# EasyEDA Pro project 延时继电器 - V2.eprj, board PCB
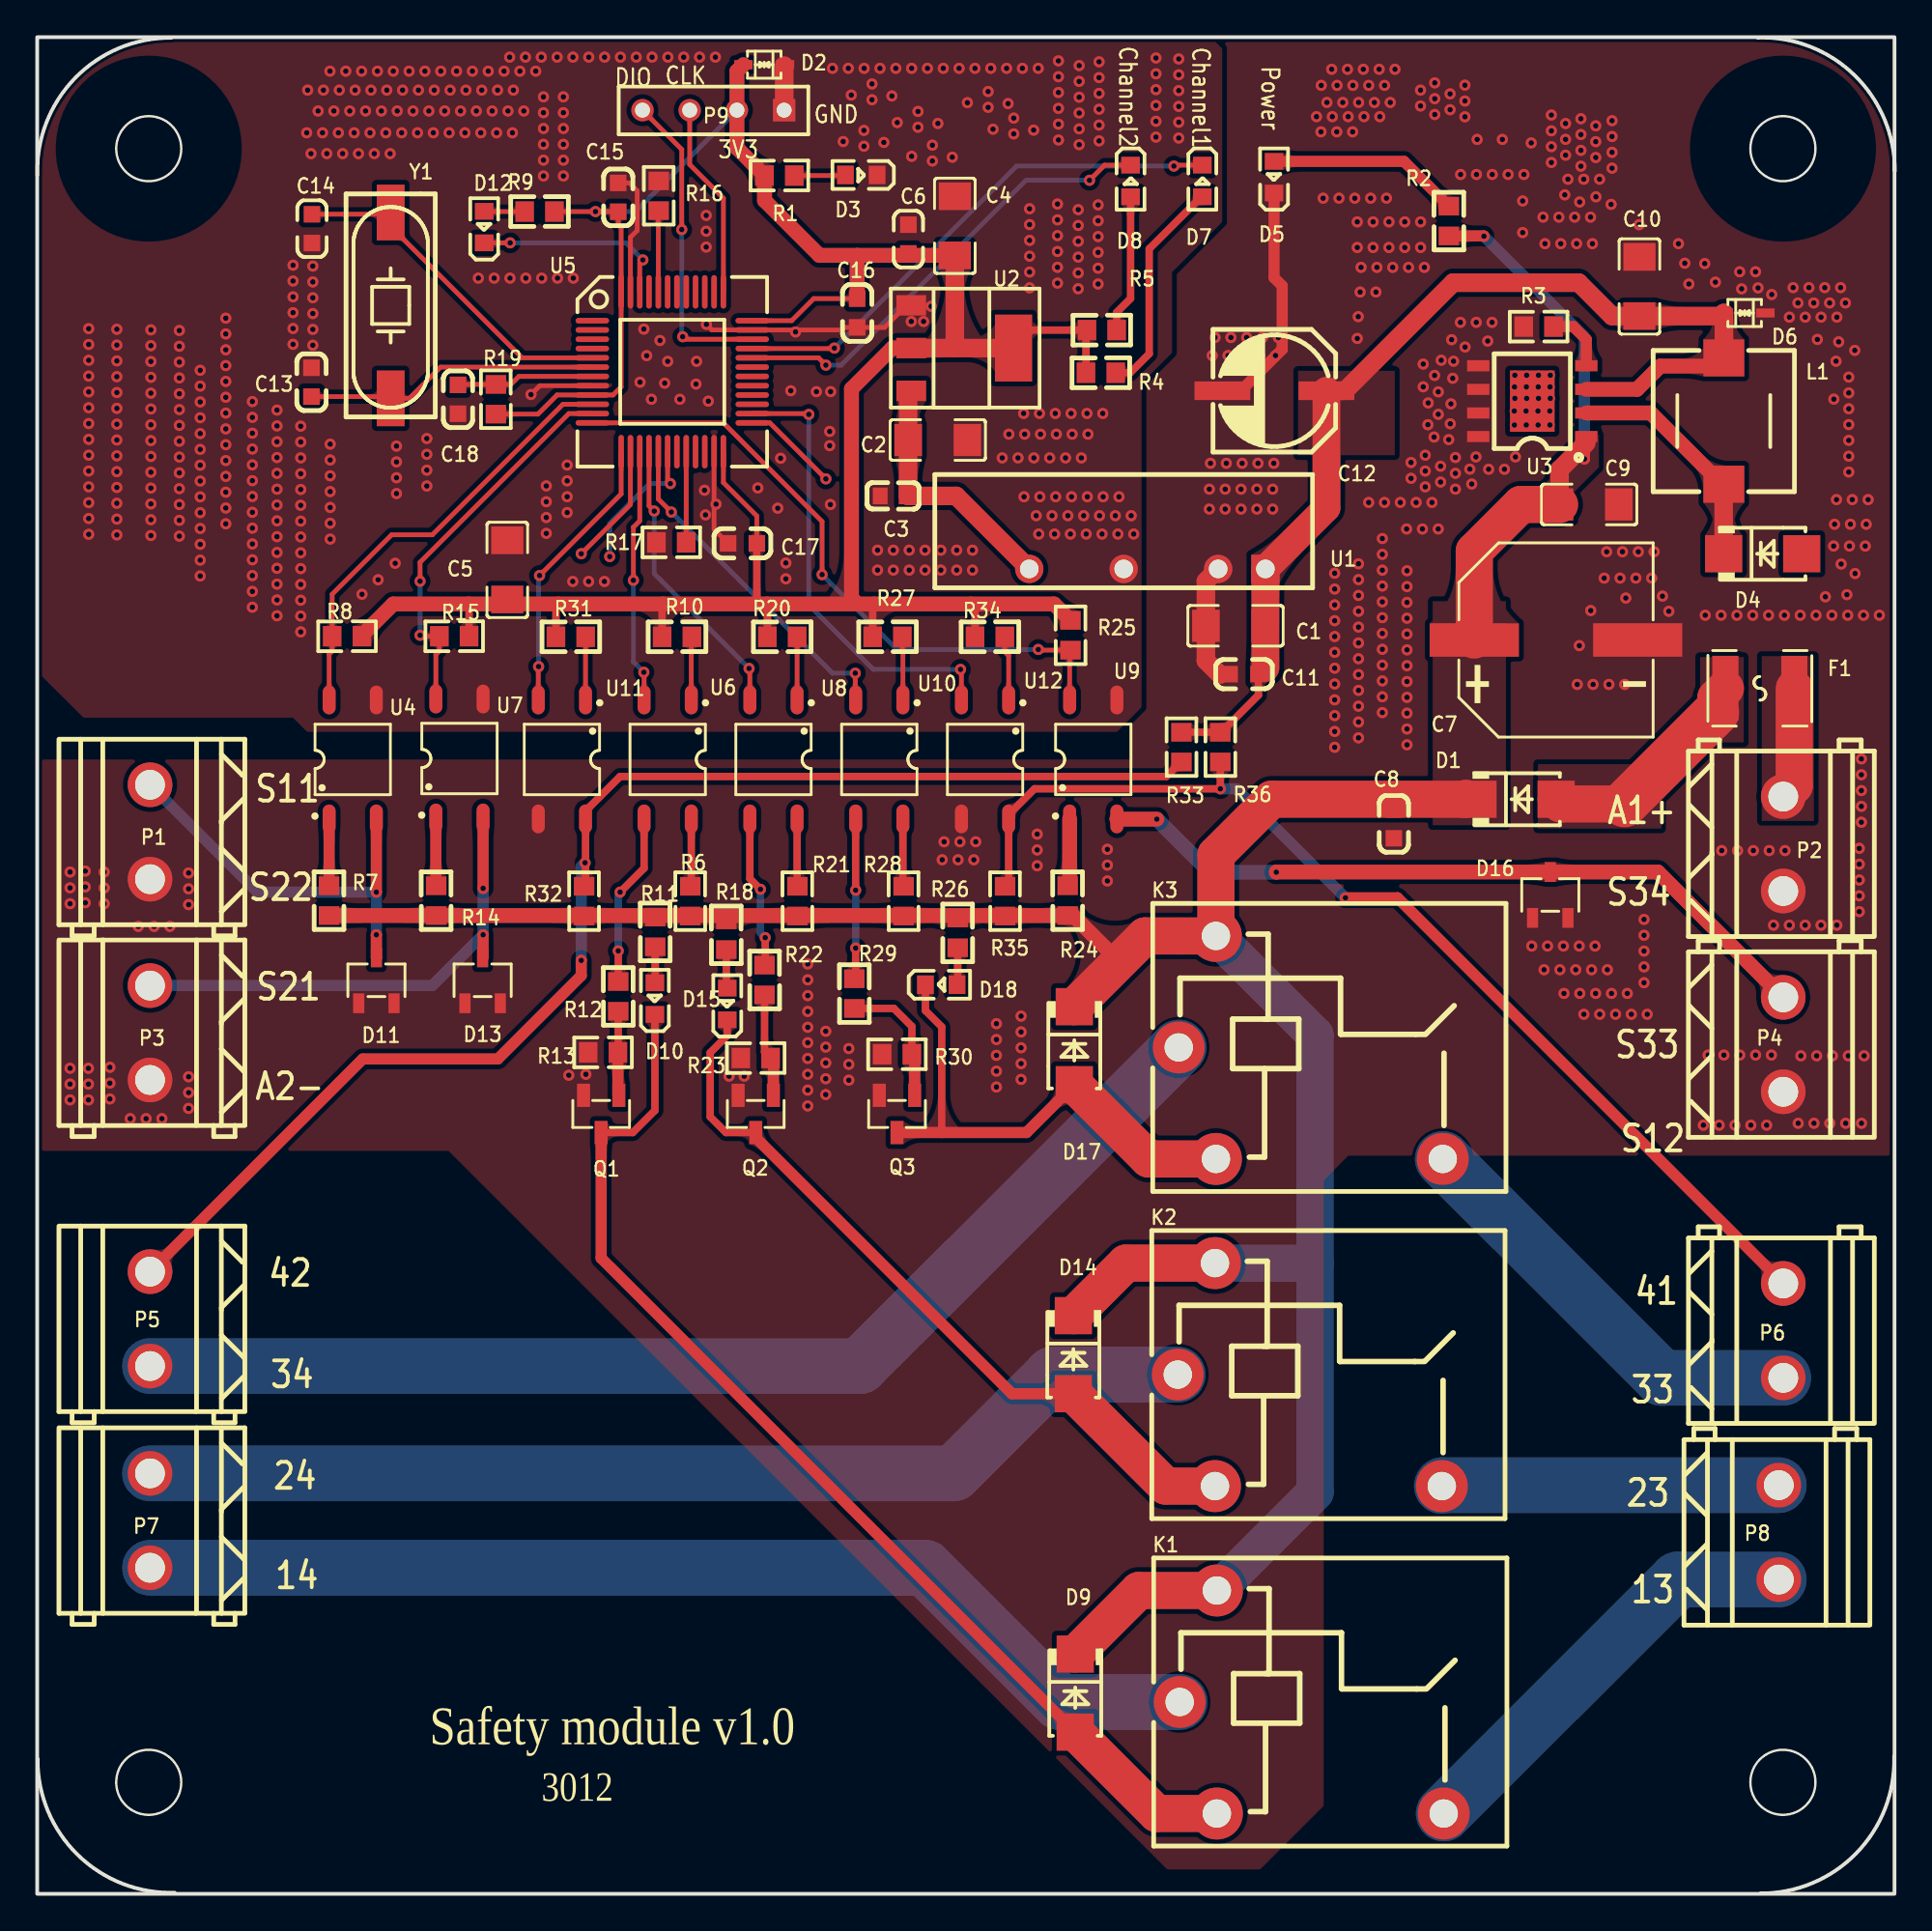
[diagram p1: board, top side]
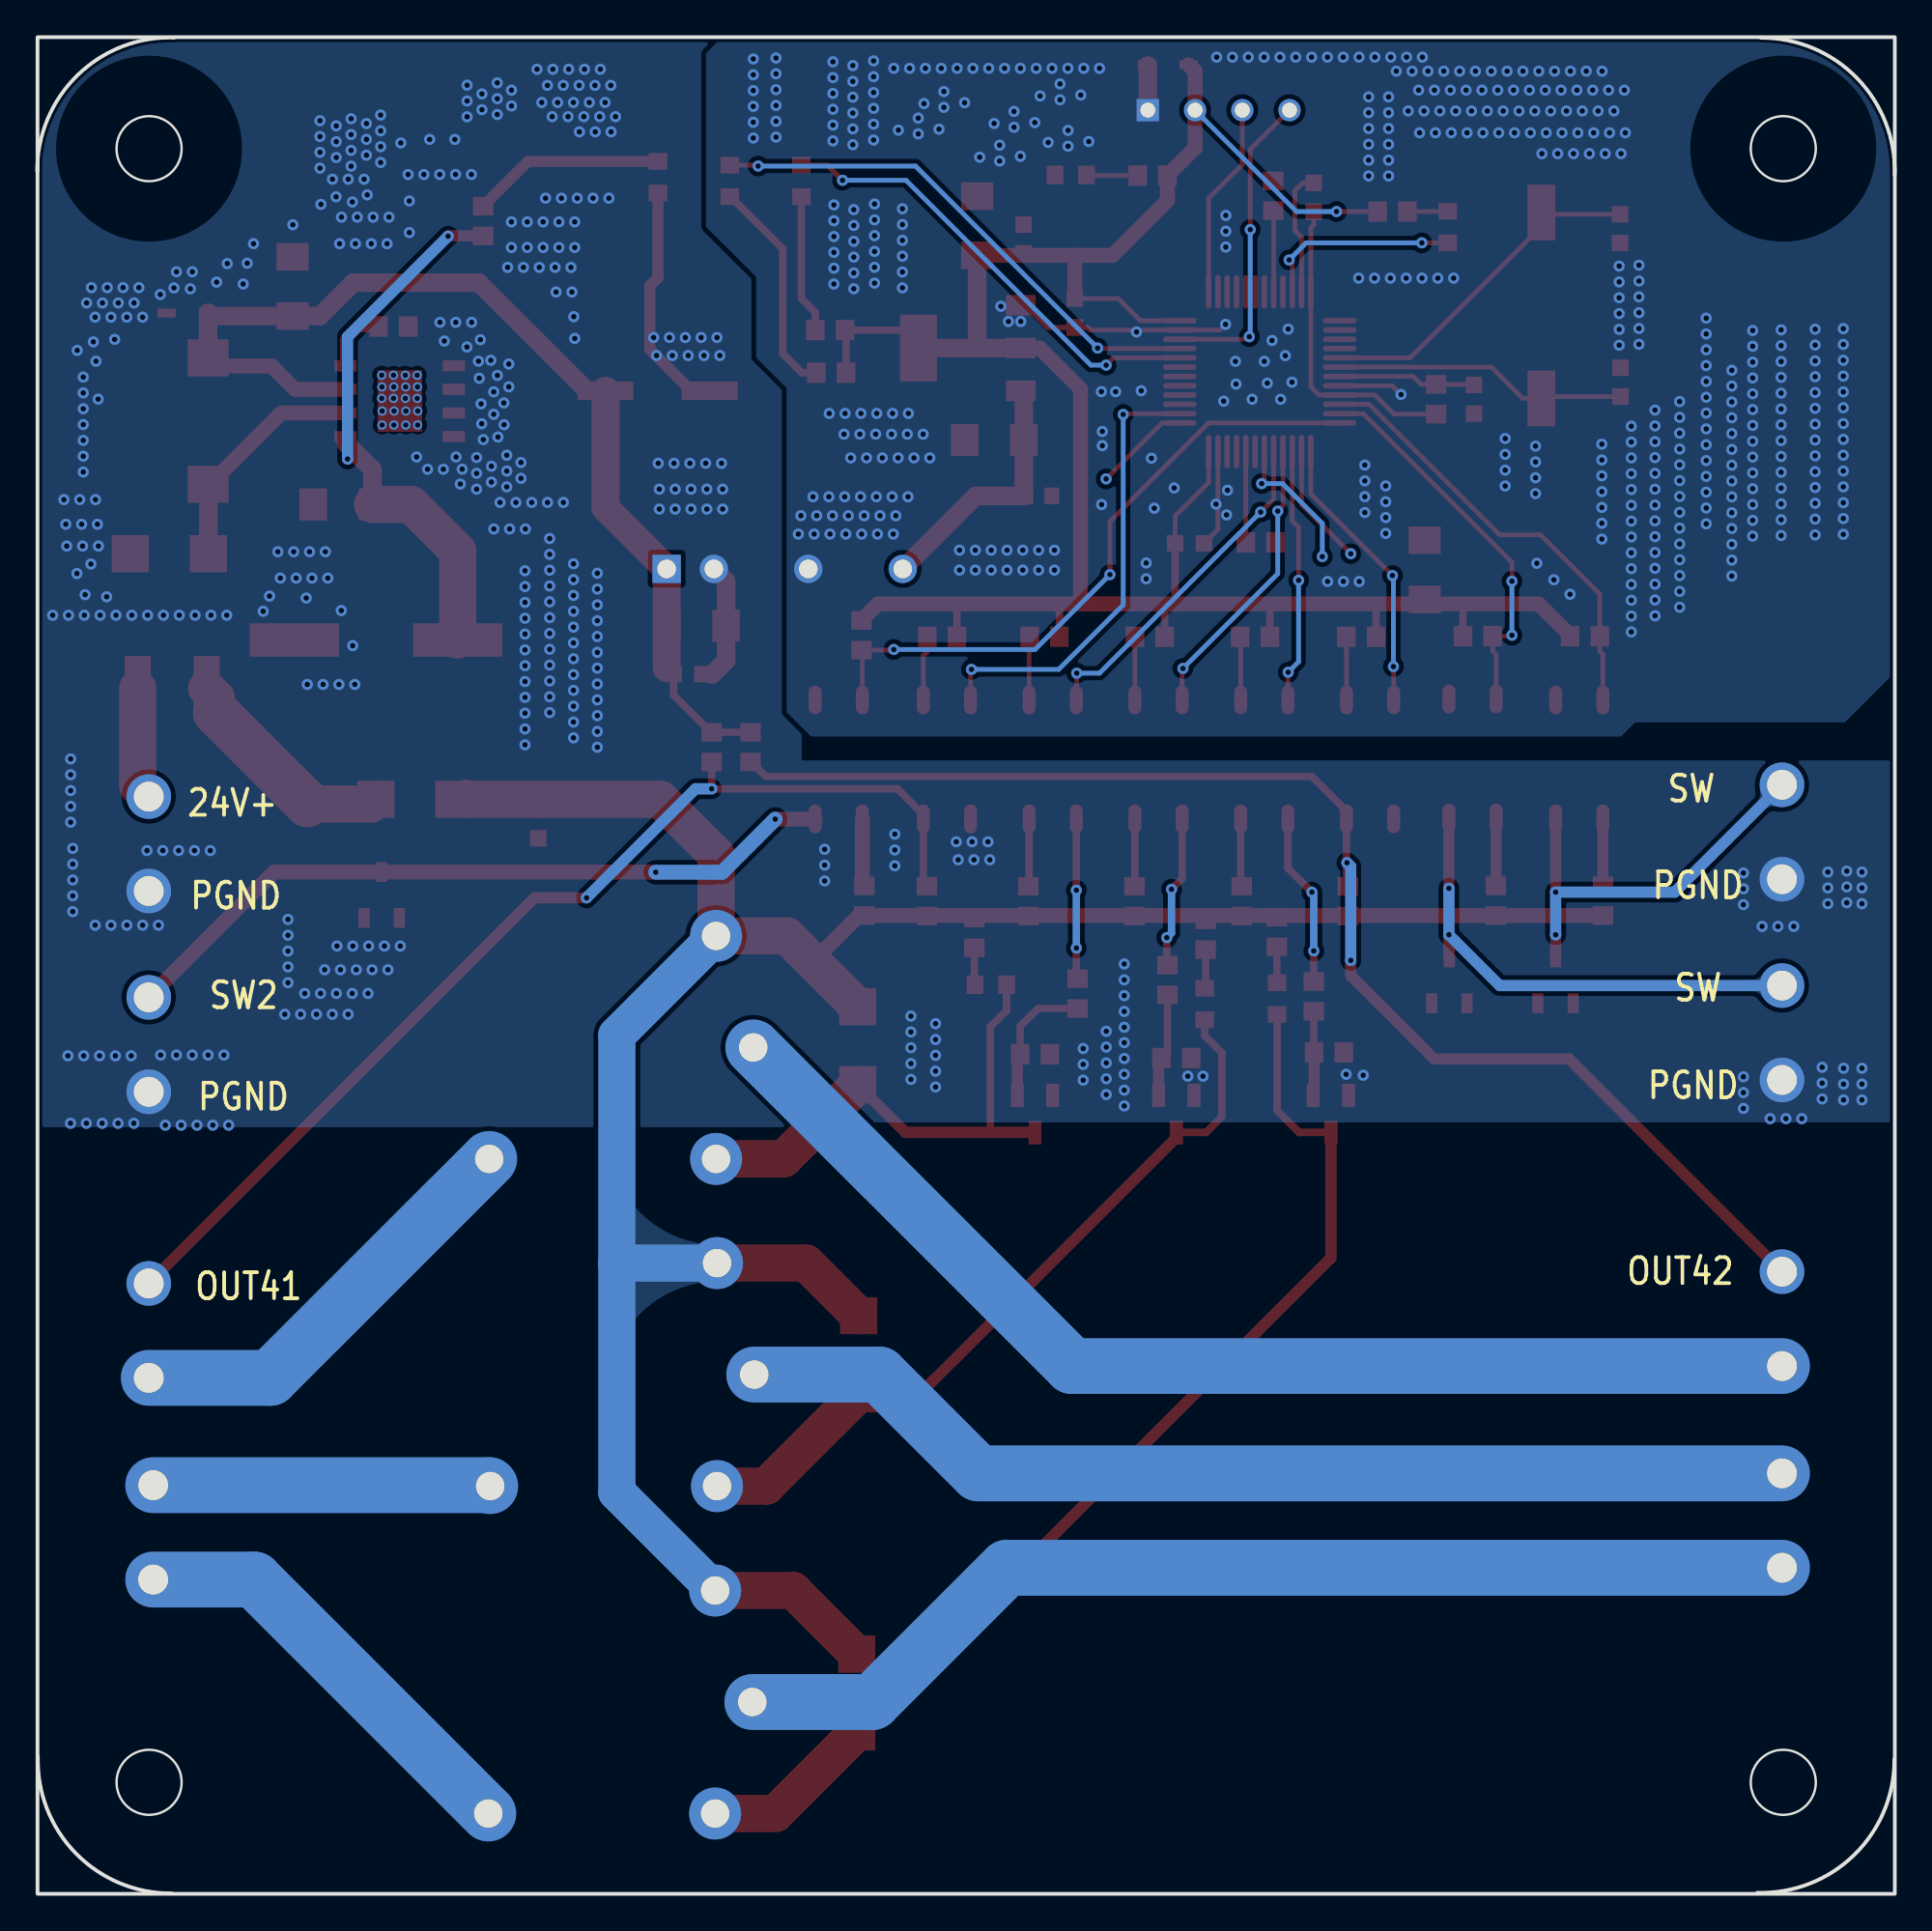
[diagram p2: board, bottom side, seen from below]

Outline 99.92 x 99.9 mm; copper layers: Top Layer, Bottom Layer. Coordinates in mm from the lower left corner of the outline.
Outline path: rectangle 0,99.9 99.9,0 ; circle c6,93.9 r1.75 ; circle c6,6 r1.75 ; circle c93.9,93.9 r1.75 ; circle c93.9,6 r1.75 ; 0.01,92.49 arc(2.04,97.7) 7.2,99.87 ; 7.4,0.06 arc(2.19,2.09) 0.02,7.25 ; 92.54,99.88 arc(97.75,97.85) 99.92,92.69 ; 99.88,7.4 arc(97.85,2.19) 92.69,0.02
Stack: Top Layer 0.035mm / Dielectric1 1.51mm FR4 er 4.5 / Bottom Layer 0.035mm

## Design rules (mm)
template: 用户自定义配置
spacing Default (default): track to track 0.152, other pairs 0 to 0.152
track width Default (default): min 0.254, default 0.254, max 25.4
differential pair differentialPair (default): width min 0.127, default 0.254, max 2.54; gap min 0.152, default 0.152
via Default (default): diameter min 0.25, default 0.61, max 100.025; hole min 0.2, default 0.305, max 59.995

## Placement (name value [footprint] x y rotation side)
C1  4.7uF  [C1206]  64.45 68.23 0 top
C2  4.7uF  [C1206]  48.44 78.22 180 top
C3  104  [C0603]  46.04 75.22 0 top
C4  4.7uF  [C1206]  49.36 89.75 270 top
C5  4.7uF  [C1206]  25.29 71.24 270 top
C6  104  [0603C]  46.86 89.04 270 top
C7  100uF/50V  [CAP-SMD_BD10.0-L10.3-W10.3-LS11.0-R-RD]  81.69 67.46 180 top
C8  104  [0603C]  72.97 57.57 90 top
C9  10uF  [C1206]  83.48 74.76 180 top
C10  10uF  [C1206]  86.18 86.49 90 top
C11  104  [0603C]  64.91 65.63 0 top
C12  100uF/35V  [电解电容贴片6X6]  66.55 80.88 180 top
C13  100pF  [0603C]  14.75 81.34 90 top
C14  100pF  [0603C]  14.78 89.6 270 top
C15  104  [0603C]  31.25 91.28 270 top
C16  104  [0603C]  44.11 85.06 90 top
C17  104  [0603C]  37.93 72.67 0 top
C18  104  [0603C]  22.63 80.42 90 top
D1  SS56  [SMA]  79.6 58.9 0 top
D2  PESD3V3L1BA-N  [SOD-323_L1.8-W1.3-LS2.5-BI]  39.11 98.42 180 top
D3  红光  [0603LED]  44.36 92.5 0 top
D4  SS34  [SMA]  92.81 72.1 0 top
D5  绿光  [0603LED]  66.55 92.33 270 top
D6  PESD5V0L1BA-N  [SOD-323_L1.8-W1.3-LS2.5-BI]  91.84 85.06 180 top
D7  绿光  [0603LED]  62.65 92.2 90 top
D8  绿光  [0603LED]  58.79 92.2 90 top
D9  SS56  [SMA]  55.84 10.8 270 top
D10  绿光  [0603LED]  33.24 48.13 270 top
D11  PESD24VL2BTN  [SOT-23-3_L2.9-W1.6-P1.90-LS2.8-BR]  18.25 49.15 270 top
D12  绿光  [0603LED]  24.06 89.65 270 top
D13  PESD24VL2BTN  [SOT-23-3_L2.9-W1.6-P1.90-LS2.8-BR]  23.96 49.15 270 top
D14  SS56  [SMA]  55.73 29.01 270 top
D15  绿光  [0603LED]  37.13 47.85 270 top
D16  PESD24VL2BTN  [SOT-23-3_L2.9-W1.6-P1.90-LS2.8-BR]  81.39 53.74 270 top
D17  SS56  [SMA]  55.78 45.63 270 top
D18  绿光  [0603LED]  48.59 48.9 180 top
F1  mSMD030  [F1812]  92.66 64.86 180 top
K1  JQC-3FF/24VDC-1HS(551)  [RELAY-TH_JQC-3FF-1HXX]  68.55 10.32 0 top
K2  JQC-3FF/24VDC-1HS(551)  [RELAY-TH_JQC-3FF-1HXX]  68.45 27.94 0 top
K3  JQC-3FF/24VDC-1HS(551)  [RELAY-TH_JQC-3FF-1HXX]  68.5 45.54 0 top
L1  68uH  [IND-SMD_L7.0-W7.0_SMDRI74-330MT]  90.72 79.24 270 top
P1  5.08-2P  [CONN-TH_2P-P5.08_DB128L-5.08-2P]  6.07 57.13 90 top
P2  5.08-2P  [CONN-TH_2P-P5.08_DB128L-5.08-2P]  93.92 56.5 270 top
P3  5.08-2P  [CONN-TH_2P-P5.08_DB128L-5.08-2P]  6.07 46.33 90 top
P4  5.08-2P  [CONN-TH_2P-P5.08_DB128L-5.08-2P]  93.92 45.7 270 top
P5  5.08-2P  [CONN-TH_2P-P5.08_DB128L-5.08-2P]  6.07 30.94 90 top
P6  5.08-2P  [CONN-TH_2P-P5.08_DB128L-5.08-2P]  93.92 30.3 270 top
P7  5.08-2P  [CONN-TH_2P-P5.08_DB128L-5.08-2P]  6.07 20.08 90 top
P8  5.08-2P  [CONN-TH_2P-P5.08_DB128L-5.08-2P]  93.68 19.45 270 top
P9  4P  [SIP4]  40.18 95.97 180 top
Q1  SS8050  [SOT-23-3_L2.9-W1.3-P1.90-LS2.4-BR]  30.34 41.96 90 top
Q2  SS8050  [SOT-23-3_L2.9-W1.3-P1.90-LS2.4-BR]  38.65 41.96 90 top
Q3  SS8050  [SOT-23-3_L2.9-W1.3-P1.90-LS2.4-BR]  46.25 41.96 90 top
R1  50K  [0603R]  39.92 92.45 0 top
R2  47K  [0603R]  75.93 90.01 270 top
R3  10K  [0603R]  80.76 84.33 180 top
R4  10K  [0603R]  57.21 81.85 180 top
R5  10K  [0603R]  57.26 84.14 180 top
R6  10K  [0603R]  33.24 51.76 90 top
R7  10K  [0603R]  15.7 53.44 90 top
R8  10K  [0603R]  16.67 67.67 180 top
R9  10K  [0603R]  27.02 90.52 0 top
R10  1K  [0603R]  34.41 67.64 0 top
R11  10K  [0603R]  35.13 53.41 90 top
R12  1K  [0603R]  31.25 48.29 270 top
R13  10K  [0603R]  30.44 45.28 180 top
R14  10K  [0603R]  21.46 53.44 90 top
R15  10K  [0603R]  22.43 67.67 180 top
R16  10K  [0603R]  33.43 91.37 270 top
R17  10K  [0603R]  34.11 72.72 0 top
R18  10K  [0603R]  37.07 51.6 90 top
R19  10K  [0603R]  24.67 80.42 90 top
R20  1K  [0603R]  40.08 67.64 0 top
R21  10K  [0603R]  40.89 53.41 90 top
R22  1K  [0603R]  39.12 49.17 270 top
R23  10K  [0603R]  38.65 44.97 180 top
R24  10K  [0603R]  55.43 53.44 90 top
R25  10K  [0603R]  55.58 67.72 270 top
R26  10K  [0603R]  49.51 51.7 90 top
R27  1K  [0603R]  45.74 67.64 0 top
R28  10K  [0603R]  46.6 53.41 90 top
R29  1K  [0603R]  43.95 48.44 270 top
R30  10K  [0603R]  46.25 45.18 180 top
R31  1K  [0603R]  28.7 67.64 0 top
R32  10K  [0603R]  29.42 53.41 90 top
R33  10K  [0603R]  61.55 61.7 270 top
R34  1K  [0603R]  51.25 67.64 0 top
R35  10K  [0603R]  52.06 53.41 90 top
R36  10K  [0603R]  63.64 61.7 270 top
U1  B0505LS-1WR3  [PWRM-TH_BXXXXLS-1WR3]  59.71 71.29 180 top
U2  1117-3.3  [SOT-223]  49.72 83.17 270 top
U3  XL1509-5.0E1  [ESOP-8_L4.9-W3.9-P1.27-LS6.0-BL-EP]  80.42 80.32 90 top
U4  LTV-357T-C  [SOP-4_L4.4-W3.9-P2.54-LS7.0-TL]  16.97 61.04 90 top
U5  STM32F103C8T6/CBT6  [LQFP48]  34.16 81.9 0 top
U6  LTV-357T-C  [SOP-4_L4.4-W3.9-P2.54-LS7.0-TL]  33.91 61.04 270 top
U7  LTV-357T-C  [SOP-4_L4.4-W3.9-P2.54-LS7.0-TL]  22.71 61.09 90 top
U8  LTV-357T-C  [SOP-4_L4.4-W3.9-P2.54-LS7.0-TL]  39.6 61.04 270 top
U9  LTV-357T-C  [SOP-4_L4.4-W3.9-P2.54-LS7.0-TL]  56.8 61.04 90 top
U10  LTV-357T-C  [SOP-4_L4.4-W3.9-P2.54-LS7.0-TL]  45.29 61.04 270 top
U11  LTV-357T-C  [SOP-4_L4.4-W3.9-P2.54-LS7.0-TL]  28.22 61.04 270 top
U12  LTV-357T-C  [SOP-4_L4.4-W3.9-P2.54-LS7.0-TL]  50.98 61.04 270 top
Y1  8M  [晶振贴片]  19.01 85.47 270 top

## Footprints (pads in the part's own frame, mm; a bottom-side part is the same pattern mirrored in y, then rotated)
0603C
  rect 0.889x0.889 smd: 1(-0.774,0) 2(0.774,0)
0603LED
  rect 0.9x1 smd: 1(-0.884,-0.017) 2(0.816,-0.017)
0603R
  rect 1x1.1 smd: 1(-0.8,0) 2(0.8,0)
C0603
  rect 0.8x0.9 smd: 1(-0.7,0) 2(0.7,0)
C1206
  rect 1.485x1.728 smd: 1(-1.593,0) 2(1.593,0)
CAP-SMD_BD10.0-L10.3-W10.3-LS11.0-R-RD
  rect 4.8x1.8 smd: 1(4.395,0) 2(-4.395,0)
CONN-TH_2P-P5.08_DB128L-5.08-2P
  round 2.401 hole 1.6: 1(-2.54,0) 2(2.54,0)
ESOP-8_L4.9-W3.9-P1.27-LS6.0-BL-EP
  rect 0.6x1.2 smd: 1(-1.905,-2.909) 2(-0.635,-2.909) 3(0.635,-2.909) 4(1.905,-2.909) 5(1.905,2.909) 6(0.635,2.909) 7(-0.635,2.909) 8(-1.905,2.909)
  rect 3.3x2.4 smd: 9(0,0)
F1812
  rect 1.407x3.499 smd: 1(-1.853,0) 2(1.853,0)
IND-SMD_L7.0-W7.0_SMDRI74-330MT
  rect 2x2.2 smd: 1(-3.4,0) 2(3.4,0)
LQFP48
  oval 1.8x0.3 smd: 1(-4.3,2.75) 2(-4.3,2.25) 3(-4.3,1.75) 4(-4.3,1.25) 5(-4.3,0.75) 6(-4.3,0.25) 7(-4.3,-0.25) 8(-4.3,-0.75) 9(-4.3,-1.25) 10(-4.3,-1.75) 11(-4.3,-2.25) 12(-4.3,-2.75) 25(4.3,-2.75) 26(4.3,-2.25) 27(4.3,-1.75) 28(4.3,-1.25) 29(4.3,-0.75) 30(4.3,-0.25) 31(4.3,0.25) 32(4.3,0.75) 33(4.3,1.25) 34(4.3,1.75) 35(4.3,2.25) 36(4.3,2.75)
  oval 0.3x1.8 smd: 13(-2.75,-4.3) 14(-2.25,-4.3) 15(-1.75,-4.3) 16(-1.25,-4.3) 17(-0.75,-4.3) 18(-0.25,-4.3) 19(0.25,-4.3) 20(0.75,-4.3) 21(1.25,-4.3) 22(1.75,-4.3) 23(2.25,-4.3) 24(2.75,-4.3) 37(2.75,4.3) 38(2.25,4.3) 39(1.75,4.3) 40(1.25,4.3) 41(0.75,4.3) 42(0.25,4.3) 43(-0.25,4.3) 44(-0.75,4.3) 45(-1.25,4.3) 46(-1.75,4.3) 47(-2.25,4.3) 48(-2.75,4.3)
PWRM-TH_BXXXXLS-1WR3
  rect 1.524x1.524 hole 1: 1(-6.35,0)
  round 1.524 hole 1: 2(-3.81,0) 4(1.27,0) 6(6.35,0)
RELAY-TH_JQC-3FF-1HXX
  round 2.794 hole 1.524: 1(-5.1,6) 2(-5.1,-6) 3(7.1,-6) 4(-7.1,0)
SIP4
  rect 1.2x1.2 hole 0.8: 1(0,0)
  round 1.2 hole 0.8: 2(2.54,0) 3(5.08,0) 4(7.62,0)
SMA
  rect 2x2 smd: 1(2.1,0) 2(-2.1,0)
SOD-323_L1.8-W1.3-LS2.5-BI
  rect 0.986x0.49 smd: 1(-1.117,0) 2(1.117,0)
SOP-4_L4.4-W3.9-P2.54-LS7.0-TL
  oval 1.55x0.7 smd: 1(-3.2,1.27) 2(-3.2,-1.27) 3(3.2,-1.27) 4(3.2,1.27)
SOT-23-3_L2.9-W1.3-P1.90-LS2.4-BR
  rect 1.25x0.7 smd: 1(1,-0.95) 2(1,0.95) 3(-1,0)
SOT-23-3_L2.9-W1.6-P1.90-LS2.8-BR
  rect 1.07x0.6 smd: 1(1.235,-0.95) 2(1.235,0.95) 3(-1.235,0)
SOT-223
  rect 1.1x1.6 smd: 1(-2.3,-2.7) 2(0,-2.7) 3(2.3,-2.7)
  rect 3.6x2 smd: 4(0,2.8)
晶振贴片
  rect 3x1.5 smd: 1(-5,0) 2(5,0)
电解电容贴片6X6
  rect 3x1 smd: 1(-2.8,0) 2(2.8,0)

## Nets
As in the schematic.

Pads without a net: U3 9; U5 1 2 3 4 18 21 22 45

## Via types
v1: diameter 0.5, hole 0.3, Top Layer to Bottom Layer, 20 vias
v2: diameter 0.6, hole 0.3, Top Layer to Bottom Layer, 919 vias

## Routing (per net, layer and track width the routed paths; a pad name or vN(x,y) marks a point on that pad's centre or on a via; arc(x,y) is an arc through that point)
3V3: length 150.1
  Top Layer w0.254: C17.2 38.71,74.13 36.91,75.93 36.91,77.6 ; U5.36 40.58,84.65 41.77,85.83 C16.2 ; R19.1 26.93,79.62 27.96,80.65 U5.9 30.97,80.65 31.41,81.08 U5.48 31.41,89.65 31.25,89.81 C15.2 31.24,90.52 v2(30.03,90.52) R9.2
  Top Layer w0.4: R34.1 50.45,69.17 50.22,69.4 ; U2.4 53.48,84.14 R5.2 56.41,84.09 R4.2 ; 39.28,67.64 39.28,69.38 39.25,69.4 ; 28.02,69.4 27.9,69.28 R31.1 ; 33.66,69.4 33.61,69.36 R10.1 ; 38.71,69.4 38.71,69.41 C17.2 ; R15.1 23.23,69.38 23.21,69.4 ; 45.02,69.4 44.94,69.32 R27.1
  Top Layer w0.8: D2.2 37.64,98.07 P9.2 37.64,93.94 R1.1 39.12,91.11 42.08,88.16 44.11,88.16 ; 44.11,88.16 C16.2 ; 44.11,88.16 C4.2 ; 44.11,69.4 19.15,69.4 17.47,67.72 R8.1 ; 44.11,69.4 43.8,69.72 43.8,80.98 45.99,83.17 U2.2 ; 44.11,69.4 54.7,69.4 55.58,68.52
  Top Layer w1: 49.32,83.17 49.36,83.21 C4.2 ; 49.32,83.17 U2.4 ; 49.32,83.17 U2.2
  Bottom Layer w0.254: v2(30.03,90.52) 32.18,90.52 P9.2
5V_MCU: length 13.9
  Top Layer w1: U1.6 49.43,75.22 46.85,75.22 46.85,80.7 U2.3
5V_VCC: length 57.5
  Top Layer w0.4: C11.2 65.69,64.5 63.69,62.5 R36.1 R33.1
  Top Layer w0.8: U3.3 86.05,80.95 87.3,82.2 90.28,82.2 90.72,82.64
  Top Layer w1: 90.72,82.64 90.72,82.65 D6.2 90.56,84.89 C10.1 84.71,84.89 82.92,86.69 76.16,86.69 70.35,80.88 C12.1
  Top Layer w1.5: 66.06,65.96 U1.1 69.35,74.57 C12.1
24V: length 6.1
  Top Layer w2: F1.1 94.51,59.63 P2.1
PGND: length 19
  Top Layer w0.6: C12.2 64.75,80.88 66.97,83.1 66.97,86.52 66.53,86.96 D5.2
  Top Layer w1: U1.2 62.86,70.63 C1.1 62.86,66.35 63.61,65.6
  vias: v2(1.77,54.98) v2(1.77,54.13) v2(1.77,53.28) v2(1.77,44.42) v2(1.77,43.57) v2(1.77,42.72) v2(2.58,55.03) v2(2.58,54.18) v2(2.58,53.33) v2(2.76,44.42) v2(2.76,43.57) v2(2.76,42.72) v2(3.6,54.98) v2(3.6,54.13) v2(3.6,53.28) v2(3.91,44.47) v2(3.91,43.62) v2(3.91,42.77) v2(5,41.71) v2(5.44,52.05) v2(5.86,41.71) v2(6.29,52.05) v2(6.71,41.71) v2(7.14,52.05) v2(8.14,54.93) v2(8.14,54.08) v2(8.14,53.22) v2(8.14,43.96) v2(8.14,43.11) v2(8.14,42.26) v2(28.59,44.05) v2(29.51,44.1) v2(37.21,43.99) v2(38.03,43.99) v2(41.45,50.03) v2(41.45,49.18) v2(41.45,48.33) v2(41.45,47.48) v2(41.45,46.63) v2(41.45,45.8) v2(41.45,44.95) v2(41.45,44.1) v2(41.45,43.24) v2(41.45,42.39) v2(42.42,46.41) v2(42.42,45.56) v2(42.42,44.71) v2(42.42,43.86) v2(42.42,43) v2(43.66,45.48) v2(43.66,44.63) v2(43.66,43.78) v2(48.68,55.64) v2(48.78,56.61) v2(49.53,55.64) v2(49.63,56.61) v2(50.38,55.64) v2(50.48,56.61) v2(51.6,46.82) v2(51.6,45.97) v2(51.6,45.12) v2(51.6,44.26) v2(51.6,43.41) v2(52.92,47.23) v2(52.92,46.38) v2(52.92,45.52) v2(52.92,44.67) v2(52.92,43.82) v2(53.79,57.02) v2(53.79,56.17) v2(53.79,55.32) v2(57.56,56.2) v2(57.56,55.35) v2(57.56,54.5) v2(63.11,76.97) v2(63.05,75.58) v2(63.05,74.51) v2(63.2,82.77) v2(63.35,83.74) v2(63.9,75.58) v2(63.9,74.51) v2(63.96,76.97) v2(64.05,82.77) v2(64.21,83.74) v2(64.81,76.97) v2(64.75,75.58) v2(64.75,74.51) v2(64.9,82.77) v2(65.06,83.74) v2(65.6,75.58) v2(65.6,74.51) v2(65.66,76.97) v2(65.76,82.77) v2(65.91,83.74) v2(66.45,75.58) v2(66.45,74.51) v2(66.61,82.77) v2(66.51,76.97) v2(66.76,83.74) v2(68.81,95.62) v2(69.07,97.31) v2(69.05,94.81) v2(69.17,91.24) v2(69.37,96.39) v2(69.63,98.17) v2(69.66,95.62) v2(69.79,71.06) v2(69.79,70.2) v2(69.79,69.35) v2(69.79,68.5) v2(69.79,67.65) v2(69.79,66.8) v2(69.79,65.95) v2(69.79,65.1) v2(69.79,64.25) v2(69.79,63.39) v2(69.79,62.54) v2(69.79,61.69) v2(69.9,94.81) v2(69.92,97.31) v2(70.02,91.24) v2(70.22,96.39) v2(70.48,98.17) v2(70.51,95.62) v2(70.77,97.31) v2(70.75,94.81) v2(70.87,91.24) v2(71,89.96) v2(71,88.58) v2(71,83.69) v2(71.07,96.39) v2(71.06,84.86) v2(71.07,71.56) v2(71.07,70.71) v2(71.07,69.86) v2(71.07,69.01) v2(71.07,68.16) v2(71.07,67.31) v2(71.07,66.46) v2(71.07,65.6) v2(71.07,64.75) v2(71.07,63.9) v2(71.07,63.05) v2(71.07,62.2) v2(71.21,87.51) v2(71.16,86.19) v2(71.33,98.17) v2(71.37,95.62) v2(71.62,97.31) v2(71.62,74.87) v2(71.72,91.24) v2(71.86,89.96) v2(71.86,88.58) v2(71.93,96.39) v2(72.01,86.19) v2(72.06,87.51) v2(72.18,98.17) v2(72.22,95.62) v2(72.35,72.92) v2(72.35,72.07) v2(72.35,71.22) v2(72.35,70.37) v2(72.35,69.52) v2(72.35,68.67) v2(72.35,67.81) v2(72.35,66.96) v2(72.35,66.11) v2(72.35,65.26) v2(72.35,64.41) v2(72.35,63.56) v2(72.47,97.31) v2(72.47,74.87) v2(72.57,91.24) v2(72.71,89.96) v2(72.71,88.58) v2(72.78,96.39) v2(72.91,87.51) v2(73.03,98.17) v2(73.32,74.87) v2(73.56,89.96) v2(73.56,88.58) v2(73.66,73.44) v2(73.68,71.19) v2(73.68,70.34) v2(73.68,69.49) v2(73.68,68.63) v2(73.68,67.78) v2(73.68,66.93) v2(73.68,66.08) v2(73.68,65.23) v2(73.68,64.38) v2(73.68,63.53) v2(73.68,62.68) v2(73.68,61.82) v2(73.76,87.51) v2(73.9,77.01) v2(73.9,76.16) v2(74.17,74.87) v2(74.41,97.05) v2(74.41,96.2) v2(74.41,89.96) v2(74.41,88.58) v2(74.51,73.44) v2(74.55,82.31) v2(74.55,81.09) v2(74.61,87.51) v2(74.66,77.41) v2(74.66,76.55) v2(74.66,75.7) v2(74.8,79.05) v2(74.82,80.22) v2(75.02,74.87) v2(75.17,97.44) v2(75.17,96.59) v2(75.17,95.74) v2(75.16,81.7) v2(75.14,78.38) v2(75.36,80.82) v2(75.36,79.61) v2(75.36,73.44) v2(75.48,76.81) v2(75.48,75.96) v2(75.52,82.52) v2(76,96.85) v2(76,96) v2(76.01,79.1) v2(75.92,78.25) v2(76.08,83.62) v2(76.04,80.17) v2(76.18,82.46) v2(76.14,81.55) v2(76.28,77.28) v2(76.28,76.43) v2(76.28,75.58) v2(76.56,92.51) v2(76.55,84.56) v2(76.79,97.32) v2(76.79,96.47) v2(76.79,95.61) v2(76.8,83.23) v2(77.06,76.66) v2(77.16,75.86) v2(77.4,84.56) v2(77.39,77.31) v2(77.45,94.4) v2(77.41,92.51) v2(78.02,83.55) v2(78.07,76.65) v2(78.27,92.51) v2(78.25,84.56) v2(78.81,94.4) v2(78.92,76.65) v2(79.12,92.51) v2(79.51,77.31) v2(79.9,91.09) v2(79.9,89.38) v2(79.97,92.51) v2(80.36,94.21) v2(80.39,51) v2(81,90.22) v2(81.1,88.79) v2(81.05,49.72) v2(81.24,51) v2(81.44,95.71) v2(81.44,94.86) v2(81.44,94.01) v2(81.44,93.16) v2(81.85,90.22) v2(81.9,49.72) v2(81.95,88.79) v2(82.09,51) v2(82.21,95.25) v2(82.21,94.4) v2(82.21,93.55) v2(82.17,91.42) v2(82.12,48.45) v2(82.33,92.26) v2(82.7,90.22) v2(82.8,88.79) v2(82.75,49.72) v2(82.84,65.07) v2(82.97,91.03) v2(82.95,67.16) v2(82.94,51) v2(82.97,48.45) v2(83.03,95.51) v2(83.03,94.66) v2(83.03,93.81) v2(83.03,92.96) v2(83.19,92.26) v2(83.19,47.33) v2(83.55,90.22) v2(83.56,69.05) v2(83.61,49.72) v2(83.65,88.79) v2(83.69,65.07) v2(83.79,51) v2(83.83,95.13) v2(83.83,94.28) v2(83.83,93.43) v2(83.84,91.31) v2(83.83,48.45) v2(84.04,92.26) v2(84.04,47.33) v2(84.29,70.79) v2(84.42,72.21) v2(84.46,49.72) v2(84.54,65.07) v2(84.71,95.41) v2(84.71,94.55) v2(84.71,93.7) v2(84.71,92.85) v2(84.66,90.9) v2(84.68,48.45) v2(84.9,47.33) v2(85.14,70.79) v2(85.27,72.21) v2(85.39,65.07) v2(85.45,69.72) v2(85.53,48.45) v2(85.75,47.33) v2(85.99,70.79) v2(86.17,89.81) v2(86.12,72.21) v2(86.43,52.43) v2(86.43,51.58) v2(86.43,50.73) v2(86.43,49.87) v2(86.43,49.02) v2(86.6,47.33) v2(86.84,70.79) v2(86.97,72.21) v2(87.42,69.82) v2(87.76,69.01) v2(88.28,88.79) v2(88.62,87.74) v2(88.84,86.62) v2(89.69,87.72) v2(89.62,41.36) v2(89.72,68.8) v2(89.88,45.13) v2(90.27,86.72) v2(90.47,41.36) v2(90.57,68.8) v2(90.61,56.13) v2(90.73,45.13) v2(91.32,41.36) v2(91.42,68.8) v2(91.46,56.13) v2(91.57,87.28) v2(91.58,45.13) v2(91.68,86.36) v2(92.17,41.36) v2(92.28,68.8) v2(92.31,56.13) v2(92.43,87.28) v2(92.43,45.13) v2(92.56,86.41) v2(93.03,41.36) v2(93.13,68.8) v2(93.16,56.13) v2(93.3,86.05) v2(93.28,45.13) v2(93.39,52.12) v2(93.98,68.8) v2(94.01,56.13) v2(94.25,84.83) v2(94.25,52.12) v2(94.45,86.42) v2(94.71,85.6) v2(94.72,41.46) v2(94.83,68.8) v2(94.86,45.09) v2(95.1,84.83) v2(95.1,52.12) v2(95.3,86.42) v2(95.56,85.6) v2(95.57,41.46) v2(95.68,68.8) v2(95.75,83.64) v2(95.71,45.09) v2(95.95,84.83) v2(95.95,52.12) v2(96.15,86.42) v2(96.18,69.79) v2(96.41,85.6) v2(96.42,41.46) v2(96.53,68.8) v2(96.56,45.09) v2(96.64,80.42) v2(96.68,73.69) v2(96.63,72.52) v2(96.8,84.83) v2(96.76,82.46) v2(96.78,75.02) v2(96.8,52.12) v2(96.9,83.51) v2(97,86.42) v2(97.03,71.55) v2(97.26,85.6) v2(97.27,41.46) v2(97.34,69.9) v2(97.38,68.8) v2(97.44,81.61) v2(97.44,80.76) v2(97.44,79.91) v2(97.44,79.06) v2(97.44,78.2) v2(97.44,77.35) v2(97.44,76.5) v2(97.48,72.52) v2(97.42,45.09) v2(97.53,73.69) v2(97.63,75.02) v2(97.76,83.05) v2(97.78,71.04) v2(98.01,56.25) v2(98.01,55.4) v2(98.01,54.55) v2(98.01,53.7) v2(98.01,52.85) v2(98.12,61.06) v2(98.12,60.21) v2(98.12,59.36) v2(98.12,58.51) v2(98.12,57.66) v2(98.12,41.46) v2(98.23,68.8) v2(98.27,45.09) v2(98.38,73.69) v2(98.33,72.52) v2(98.48,75.02) v2(99.09,68.8)
SGND: length 29.6
  Top Layer w0.254: U5.8 27.03,81.15 v2(26.56,80.67) ; v2(36,84.45) 36.3,84.15 U5.35 43.27,84.15 43.41,84.28 C16.1 45.58,84.28 46.77,85.47 U2.1 ; 36.41,77.6 36.41,73.41 C17.1 ; U5.47 31.91,89.13 32.27,89.5 32.27,91.64 31.86,92.06 C15.1
  Top Layer w1: P9.1 40.18,98.37
  vias: v2(2.77,84.22) v2(2.77,83.37) v2(2.77,82.52) v2(2.77,81.66) v2(2.77,80.81) v2(2.77,79.96) v2(2.77,79.11) v2(2.77,78.26) v2(2.77,77.41) v2(2.77,76.56) v2(2.77,75.7) v2(2.77,74.85) v2(2.77,74) v2(2.77,73.15) v2(4.29,84.18) v2(4.29,83.33) v2(4.29,82.48) v2(4.29,81.63) v2(4.29,80.78) v2(4.29,79.93) v2(4.29,79.08) v2(4.29,78.23) v2(4.29,77.37) v2(4.29,76.52) v2(4.29,75.67) v2(4.29,74.82) v2(4.29,73.97) v2(4.29,73.12) v2(6.11,84.15) v2(6.11,83.3) v2(6.11,82.45) v2(6.11,81.6) v2(6.11,80.75) v2(6.11,79.89) v2(6.11,79.04) v2(6.11,78.19) v2(6.11,77.34) v2(6.11,76.49) v2(6.11,75.64) v2(6.11,74.79) v2(6.11,73.94) v2(6.11,73.08) v2(7.65,84.12) v2(7.65,83.27) v2(7.65,82.42) v2(7.65,81.56) v2(7.65,80.71) v2(7.65,79.86) v2(7.65,79.01) v2(7.65,78.16) v2(7.65,77.31) v2(7.65,76.46) v2(7.65,75.61) v2(7.65,74.75) v2(7.65,73.9) v2(7.65,73.05) v2(8.77,81.98) v2(8.77,81.13) v2(8.77,80.27) v2(8.77,79.42) v2(8.77,78.57) v2(8.77,77.72) v2(8.77,76.87) v2(8.77,76.02) v2(8.77,75.17) v2(8.77,74.31) v2(8.77,73.46) v2(8.77,72.61) v2(8.77,71.76) v2(8.77,70.91) v2(10.15,84.78) v2(10.15,83.93) v2(10.15,83.08) v2(10.15,82.23) v2(10.15,81.38) v2(10.15,80.52) v2(10.15,79.67) v2(10.15,78.82) v2(10.15,77.97) v2(10.15,77.12) v2(10.15,76.27) v2(10.15,75.42) v2(10.15,74.57) v2(10.15,73.71) v2(11.57,80.29) v2(11.57,79.44) v2(11.57,78.59) v2(11.57,77.74) v2(11.57,76.89) v2(11.57,76.04) v2(11.57,75.19) v2(11.57,74.33) v2(11.57,73.48) v2(11.57,72.63) v2(11.57,71.78) v2(11.57,70.93) v2(11.57,70.08) v2(11.57,69.23) v2(12.9,79.83) v2(12.9,78.98) v2(12.9,78.13) v2(12.9,77.28) v2(12.9,76.43) v2(12.9,75.58) v2(12.9,74.73) v2(12.9,73.88) v2(12.9,73.02) v2(12.9,72.17) v2(12.9,71.32) v2(12.9,70.47) v2(12.9,69.62) v2(12.9,68.77) v2(13.76,87.63) v2(13.76,86.78) v2(13.76,85.93) v2(13.76,85.08) v2(13.76,84.22) v2(13.76,83.37) v2(14.17,78.97) v2(14.17,78.12) v2(14.17,77.27) v2(14.17,76.41) v2(14.17,75.56) v2(14.17,74.71) v2(14.17,73.86) v2(14.17,73.01) v2(14.17,72.16) v2(14.17,71.31) v2(14.17,70.45) v2(14.17,69.6) v2(14.17,68.75) v2(14.17,67.9) v2(14.5,94.76) v2(14.55,97.05) v2(14.73,93.63) v2(14.83,87.58) v2(14.83,86.73) v2(14.83,85.88) v2(14.83,85.03) v2(14.83,84.18) v2(14.83,83.33) v2(15.11,95.93) v2(15.4,97.05) v2(15.35,94.76) v2(15.58,93.63) v2(15.75,98.07) v2(15.76,78) v2(15.76,77.15) v2(15.76,76.3) v2(15.76,75.45) v2(15.76,74.6) v2(15.76,73.75) v2(15.76,72.89) v2(15.96,95.93) v2(16.2,94.76) v2(16.25,97.05) v2(16.43,93.63) v2(16.6,98.07) v2(16.81,95.93) v2(17.1,97.05) v2(17.05,94.76) v2(17.28,93.63) v2(17.45,98.07) v2(17.47,69.92) v2(17.66,95.93) v2(17.9,94.76) v2(17.95,97.05) v2(18.13,93.63) v2(18.3,98.07) v2(18.34,70.7) v2(18.51,95.93) v2(18.8,97.05) v2(18.75,94.76) v2(18.98,93.63) v2(19.15,98.07) v2(19.26,71.59) v2(19.36,95.93) v2(19.33,77.9) v2(19.33,77.05) v2(19.33,76.19) v2(19.33,75.34) v2(19.6,94.76) v2(19.65,97.05) v2(20,98.07) v2(20.22,95.93) v2(20.51,97.05) v2(20.45,94.76) v2(20.85,98.07) v2(20.96,78.3) v2(20.96,77.45) v2(20.96,76.6) v2(20.96,75.75) v2(21.07,95.93) v2(21.31,94.76) v2(21.36,97.05) v2(21.71,98.07) v2(21.92,95.93) v2(22.21,97.05) v2(22.16,94.76) v2(22.56,98.07) v2(22.77,95.93) v2(23.01,94.76) v2(23.06,97.05) v2(23.41,98.07) v2(23.62,95.93) v2(23.73,86.93) v2(23.91,97.05) v2(23.86,94.76) v2(24.26,98.07) v2(24.47,95.93) v2(24.58,86.93) v2(24.71,94.76) v2(24.76,97.05) v2(25.11,98.07) v2(25.41,98.83) v2(25.32,95.93) v2(25.43,86.93) v2(25.56,94.76) v2(25.61,97.05) v2(25.96,98.07) v2(26.17,95.93) v2(26.26,98.83) v2(26.28,86.93) v2(26.81,98.07) v2(27.11,98.83) v2(27.13,86.93) v2(27.23,96.69) v2(27.23,95.84) v2(27.23,94.99) v2(27.23,94.13) v2(27.23,93.28) v2(27.23,92.43) v2(27.38,75.75) v2(27.38,74.9) v2(27.38,74.05) v2(27.38,73.2) v2(27.97,98.83) v2(27.99,86.93) v2(28.3,96.69) v2(28.3,95.84) v2(28.3,94.99) v2(28.3,94.13) v2(28.3,93.28) v2(28.3,92.43) v2(28.51,76.88) v2(28.51,76.03) v2(28.51,75.17) v2(28.51,74.32) v2(28.81,70.61) v2(28.82,98.83) v2(28.84,86.93) v2(29.67,98.83) v2(29.66,70.61) v2(30.51,70.61) v2(30.52,98.83) v2(31.37,98.83) v2(32.22,98.83) v2(32.43,81.34) v2(32.63,84.19) v2(32.78,82.76) v2(33.07,98.83) v2(33.04,80.42) v2(33.5,83.58) v2(33.75,81.28) v2(33.91,82.46) v2(33.92,98.83) v2(34.57,80.42) v2(34.78,98.83) v2(35.47,82.46) v2(35.44,81.23) v2(35.63,98.83) v2(35.89,75.52) v2(35.98,90.31) v2(35.98,89.46) v2(35.98,88.61) v2(35.94,74.2) v2(36.1,80.32) v2(36.48,98.83) v2(36.51,74.77) v2(38.76,75.65) v2(39.83,74.56) v2(39.99,77.24) v2(40.27,71.61) v2(40.27,70.76) v2(40.53,80.88) v2(40.79,84.04) v2(41.91,80.83) v2(42.68,80.83) v2(42.63,78.69) v2(42.63,77.92) v2(42.67,74.75) v2(42.78,98.22) v2(43.35,94.28) v2(43.63,98.22) v2(43.79,96.79) v2(44.48,98.22) v2(44.47,94.88) v2(44.47,94.03) v2(44.9,97.38) v2(44.9,96.53) v2(45.2,72.3) v2(45.2,71.23) v2(45.33,98.22) v2(45.54,94.24) v2(45.97,96.74) v2(46.05,72.3) v2(46.05,71.23) v2(46.18,98.22) v2(46.26,95.31) v2(46.9,72.3) v2(46.9,71.23) v2(47.03,98.22) v2(47.03,93.49) v2(47.01,84.6) v2(47.38,95.9) v2(47.38,95.05) v2(47.68,84.6) v2(47.75,72.3) v2(47.75,71.23) v2(47.89,98.22) v2(48.08,85.42) v2(48.15,94.09) v2(48.15,93.24) v2(48.45,95.26) v2(48.61,72.3) v2(48.61,71.23) v2(48.74,98.22) v2(49.22,93.44) v2(49.46,72.3) v2(49.46,71.23) v2(49.59,98.22) v2(50.03,96.38) v2(50.31,72.3) v2(50.31,71.23) v2(50.44,98.22) v2(51.15,96.97) v2(51.15,96.12) v2(51.29,98.22) v2(51.41,94.95) v2(51.91,77.26) v2(52.14,98.22) v2(52.22,96.33) v2(52.26,78.54) v2(52.53,95.55) v2(52.53,94.7) v2(52.76,77.26) v2(52.99,98.22) v2(53.06,79.65) v2(53.08,75.17) v2(53.11,78.54) v2(53.38,90.67) v2(53.38,89.82) v2(53.38,88.97) v2(53.38,88.11) v2(53.38,87.26) v2(53.38,86.41) v2(53.6,94.9) v2(53.61,77.26) v2(53.73,74.15) v2(53.84,98.22) v2(53.91,79.65) v2(53.87,73.16) v2(53.97,78.54) v2(53.93,75.17) v2(54.46,77.26) v2(54.59,74.15) v2(54.76,79.65) v2(54.78,75.17) v2(54.72,73.16) v2(54.88,90.92) v2(54.88,90.07) v2(54.88,89.22) v2(54.88,88.37) v2(54.88,87.52) v2(54.88,86.67) v2(54.82,78.54) v2(54.93,98.62) v2(54.93,97.77) v2(54.93,96.92) v2(54.93,96.07) v2(54.93,95.22) v2(54.93,94.37) v2(55.31,77.26) v2(55.44,74.15) v2(55.57,73.16) v2(55.61,79.65) v2(55.67,78.54) v2(55.63,75.17) v2(56,90.62) v2(56,89.77) v2(56,88.92) v2(56,88.07) v2(56,87.21) v2(56,86.36) v2(56.05,98.37) v2(56.05,97.52) v2(56.05,96.67) v2(56.05,95.82) v2(56.05,94.97) v2(56.05,94.11) v2(56.16,77.26) v2(56.29,74.15) v2(56.46,79.65) v2(56.48,75.17) v2(56.42,73.16) v2(56.52,78.54) v2(57.07,90.87) v2(57.07,90.02) v2(57.07,89.17) v2(57.07,88.32) v2(57.07,87.47) v2(57.07,86.62) v2(57.12,98.58) v2(57.12,97.72) v2(57.12,96.87) v2(57.12,96.02) v2(57.12,95.17) v2(57.12,94.32) v2(57.14,74.15) v2(57.28,73.16) v2(57.32,79.65) v2(57.34,75.17) v2(57.99,74.15) v2(58.19,75.17) v2(58.13,73.16) v2(58.84,74.15) v2(58.98,73.16) v2(60.18,98.78) v2(60.18,97.93) v2(60.18,97.08) v2(60.18,96.23) v2(60.18,95.37) v2(60.18,94.52) v2(61.4,98.73) v2(61.4,97.88) v2(61.4,97.03) v2(61.4,96.17) v2(61.4,95.32) v2(61.4,94.47)
VIN_24V: length 165.2
  Top Layer w0.6: v2(77.82,89.19) 77.8,89.21 R2.2 ; v2(83.22,77.2) 83.22,77.97
  Top Layer w0.8: R7.1 R14.1 55.72,52.64 57.77,50.58
  Top Layer w1: C9.2 81.88,76.63 83.22,77.97 83.32,78.07
  Top Layer w2: 76.85,58.95 76.8,58.9 66.39,58.9 63.4,55.9 K3.1 59.59,51.54 D17.2 ; 77.3,67.46 77.3,72.25 79.81,74.76 C9.2 ; D9.2 59.25,16.32 K1.1 ; D14.2 58.56,33.94 K2.1
  Bottom Layer w0.6: v2(83.22,77.2) 83.22,83.78 v2(77.82,89.19)
  Bottom Layer w2: K3.1 68.74,46.2 68.74,33.93 ; K1.1 68.74,21.61 68.74,33.93 ; 68.74,33.93 68.73,33.94 K2.1
(no net): length 7.7
  Top Layer w0.254: v2(34.06,75.88) 33.91,76.03 33.91,77.6
  Bottom Layer w0.254: v2(34.06,75.88) 32.94,75.88 30.79,73.74 v2(30.79,71.95)
  vias: v1(79.48,81.71) v1(79.46,81.08) v1(79.48,80.47) v1(79.45,79.78) v1(79.46,79.03) v1(80.1,81.08) v1(80.09,79.78) v1(80.09,79.03) v1(80.11,81.71) v1(80.11,80.47) v1(80.75,81.71) v1(80.74,81.08) v1(80.75,80.47) v1(80.72,79.78) v1(80.73,79.03) v1(81.39,81.71) v1(81.37,81.08) v1(81.39,80.47) v1(81.36,79.78) v1(81.37,79.03)
BOOT0: length 4.4
  Top Layer w0.254: U5.44 33.41,90.55 R16.2
BOOT1: length 4.9
  Top Layer w0.254: 34.91,77.6 R17.2
CH1: length 28.3
  Top Layer w0.254: v2(61.14,92.96) 61.19,93.02 D7.2 ; U5.33 42.86,83.15 v2(42.88,83.17)
  Bottom Layer w0.254: v2(42.88,83.17) 52.67,92.96 v2(61.14,92.96)
CH2: length 25
  Top Layer w0.254: v2(56.6,92.2) 57.42,93.02 D8.2 ; v2(42.42,82.25) 42.03,82.65 U5.32
  Bottom Layer w0.254: v2(42.42,82.25) 43.24,82.25 53.18,92.2 v2(56.6,92.2)
J13: length 23.2
  Bottom Layer w3: P8.2 88.24,16.91 K1.3
J14: length 58.4
  Bottom Layer w3: K1.4 54.99,10.32 47.77,17.54 P7.1
J23: length 18.1
  Bottom Layer w3: P8.1 75.6,21.99 75.55,21.94
J24: length 57.5
  Bottom Layer w3: P7.2 49.3,22.62 54.61,27.94 K2.4
J33: length 23.2
  Bottom Layer w3: P6.2 87.38,27.76 75.6,39.54
J34: length 62.4
  Bottom Layer w3: P5.1 44.26,28.4 K3.4
LED_SYS: length 10.7
  Top Layer w0.254: v2(32.58,87.91) 32.41,87.75 U5.46 ; v2(25.44,88.83) D12.2
  Bottom Layer w0.254: v2(32.58,87.91) 31.66,88.83 v2(25.44,88.83)
MISO: length 15.6
  Top Layer w0.254: 32.91,77.6 32.91,74.68 v2(33.19,74.4) ; 38.33,64.24 38.33,65.89 v2(38.29,65.93)
  Bottom Layer w0.254: v2(33.19,74.4) 33.19,71.03 v2(38.29,65.93)
MOSI: length 18.5
  Top Layer w0.254: v2(44,65.68) 44,64.26 U10.2 ; 33.41,77.6 33.41,75.05 v2(34.11,74.35)
  Bottom Layer w0.254: v2(44,65.68) 42.78,65.68 v2(34.11,74.35)
NRST: length 7.4
  Top Layer w0.254: C18.2 22.66,81.22 R19.2 25.48,81.22 25.91,81.65 U5.7
OUT41: length 58.6
  Top Layer w0.4: R35.2 52.25,54.4 U12.4 52.25,58.07 53.64,59.46 v2(63.64,59.46) R36.2
  Top Layer w0.6: v2(70.37,53.59) 73.17,53.59 P6.1
  Bottom Layer w0.6: v2(63.64,59.46) 64.51,59.46 v2(70.37,53.59)
OUT42: length 73.2
  Top Layer w0.4: R33.2 61.51,60.9 60.73,60.12 31.35,60.12 29.49,58.26 U11.4 29.49,54.29 R32.2
  Top Layer w0.6: P5.2 17.51,44.92 24.78,44.92 29.26,49.41 v2(29.26,50.23)
  Bottom Layer w0.6: v2(29.47,55.48) 29.26,55.27 v2(29.26,50.23)
PA0: length 24
  Top Layer w0.254: U4.4 15.7,66.7 15.87,66.86 R8.2 15.87,69.93 19.06,73.12 21.26,73.12 28.28,80.15 29.91,80.15
PA1: length 21
  Top Layer w0.254: 21.44,64.29 21.44,66.68 21.63,66.86 R15.2 20.64,67.67 v2(20.59,67.72) ; v2(20.59,70.63) 20.59,71.65 28.59,79.65 U5.11
  Bottom Layer w0.254: v2(20.59,70.63) v2(20.59,67.72)
PA2: length 35.2
  Top Layer w0.254: v2(42.22,70.98) 42.22,73.84 36.91,79.15 U5.12 ; v2(53.85,66.95) 53.88,66.92 R25.2 55.53,66.87 U9.4
  Bottom Layer w0.254: v2(53.85,66.95) 46.25,66.95 v2(42.22,70.98)
PA3: length 15.2
  Top Layer w0.254: U11.2 26.95,66.02 v2(26.97,66.04) ; v2(27.02,70.93) 31.41,75.32 31.41,77.6
  Bottom Layer w0.254: v2(27.02,70.93) 26.97,70.88 v2(26.97,66.04)
PA4: length 6.6
  Top Layer w0.254: v2(29.26,72.1) 31.91,74.75 31.91,77.6
PB12: length 5.2
  Top Layer w0.254: U5.25 39.41,79.15 v2(42.42,76.13)
PB13: length 24.6
  Top Layer w0.254: v2(41.5,79.6) 41.46,79.65 U5.26 ; v2(49.66,65.88) 49.71,65.83 U12.2
  Bottom Layer w0.254: v2(41.5,79.6) 41.5,69.35 44.97,65.88 v2(49.66,65.88)
S11: length 22
  Top Layer w0.6: D11.3 18.24,50.39 v2(18.24,51.6) ; U4.2 v2(18.24,53.9)
  Bottom Layer w0.6: v2(18.24,51.6) v2(18.24,53.9) 11.84,53.9 P1.2
S21: length 26.6
  Top Layer w0.6: D13.3 23.98,50.41 v2(23.98,51.6) ; U7.2 v2(23.98,54.1)
  Bottom Layer w0.6: P3.2 21.25,48.87 v2(23.98,51.6) v2(23.98,54.1)
S33: length 39.8
  Top Layer w0.8: v2(66.65,54.97) 66.66,54.98 D16.3 87.17,54.98 P4.1 ; v2(60.22,57.82) 58.09,57.82 U9.2
  Bottom Layer w0.8: v2(66.65,54.97) 63.08,54.97 v2(60.22,57.82)
SCLK: length 13.7
  Top Layer w0.254: U6.2 32.64,65.72 v2(32.63,65.73) ; 32.41,77.6 32.41,73.87 32.07,73.53 v2(32.07,70.68)
  Bottom Layer w0.254: v2(32.07,70.68) 32.07,66.29 v2(32.63,65.73)
SWCLK: length 10.5
  Top Layer w0.254: U5.37 36.91,91.23 35.1,93.05 P9.3
SWDIO: length 16.9
  Top Layer w0.254: v2(34.67,89.55) 34.67,93.86 P9.4 ; v2(34.72,83.78) 34.86,83.65 U5.34
  Bottom Layer w0.254: v2(34.67,89.55) 34.67,83.83 v2(34.72,83.78)
XTAL1: length 18.8
  Top Layer w0.254: C14.1 18.92,90.37 Y1.1 19.01,89.72 26.08,82.65 U5.5
XTAL2: length 15.8
  Top Layer w0.254: C13.1 18.92,80.56 Y1.2 20.02,80.47 21.7,82.15 U5.6
$1N53807: length 2.2
  Top Layer w0.254: 24.04,90.53 24.06,90.52 R9.1
$1N53854: length 3.6
  Top Layer w0.8: R24.2 55.53,54.34 U9.1
$1N55881: length 2.8
  Top Layer w0.254: R1.2 43.44,92.45 D3.1
$1N58958: length 3.6
  Top Layer w0.6: R7.2 15.7,54.24 U4.1
$1N59162: length 3.7
  Top Layer w0.6: R14.2 21.44,54.25 21.44,57.89
$1N59368: length 3.4
  Top Layer w0.254: U6.1 35.18,67.6 R10.2
$1N59371: length 3.6
  Top Layer w0.4: R11.2 35.18,54.27 U6.4
$1N59536: length 9.3
  Top Layer w0.4: U6.3 32.64,55.19 v2(31.35,53.9) ; v2(31.25,50.74) R12.1
  Bottom Layer w0.4: v2(31.35,53.9) 31.25,53.8 v2(31.25,50.74)
$1N59597: length 1.9
  Top Layer w0.4: D10.1 33.24,49.03 R6.1
$1N59599: length 4.6
  Top Layer w0.4: R12.2 31.25,45.29 R13.1
  Top Layer w0.6: Q1.1 31.24,43.01 R13.1
$1N59629: length 60.8
  Top Layer w0.4: D10.2 33.22,42.15 32.04,40.96 Q1.3
  Top Layer w0.6: Q1.3 30.34,34.2 D9.1
  Top Layer w2: K1.2 60.22,4.32 D9.1
$1N60118: length 3.4
  Top Layer w0.254: R20.2 40.88,66.83 40.87,66.83 U8.1
$1N60120: length 3.6
  Top Layer w0.4: R21.2 40.87,54.23 U8.4
$1N60129: length 8.2
  Top Layer w0.4: R22.1 39.16,50 v2(39.16,51.45) ; v2(38.9,54.05) 38.33,54.62 38.33,57.84
  Bottom Layer w0.4: v2(38.9,54.05) 38.9,51.7 v2(39.16,51.45)
$1N60134: length 2.1
  Top Layer w0.4: R18.1 37.07,48.78 D15.1
$1N60136: length 5.6
  Top Layer w0.4: R22.2 39.12,45.3 R23.1
  Top Layer w0.6: Q2.1 39.6,44.82 R23.1
$1N60139: length 41.1
  Top Layer w0.4: Q2.3 37.05,40.96 36.2,41.81 36.2,45.26 37.12,46.18 D15.2
  Top Layer w0.6: Q2.3 38.65,40.69 52.43,26.91 D14.1
  Top Layer w2: K2.2 60.7,21.94 D14.1
$1N60524: length 3.4
  Top Layer w0.254: R27.2 46.54,66.83 46.56,66.8 U10.1
$1N60526: length 3.6
  Top Layer w0.4: R28.2 46.56,54.25 U10.4
$1N60535: length 8.6
  Top Layer w0.4: R29.1 44.02,49.31 v2(44.02,50.89) ; U10.3 v2(44.02,54)
  Bottom Layer w0.4: v2(44.02,54) v2(44.02,50.89)
$1N60540: length 2
  Top Layer w0.4: R26.1 49.51,48.95 D18.1
$1N60542: length 7.3
  Top Layer w0.4: R30.1 47.05,46.67 46.08,47.64 R29.2
  Top Layer w0.6: Q3.1 47.2,45.03 R30.1
$1N60545: length 28.3
  Top Layer w0.4: D18.2 47.78,47.52 48.65,46.64 48.65,40.96 ; 46.19,40.96 46.14,40.91
  Top Layer w0.6: D17.1 53.21,40.96 Q3.3
  Top Layer w2: D17.1 59.78,39.54 K3.2
$1N62788: length 11.9
  Top Layer w0.4: R4.1 58.79,81.85 59.81,82.87 59.81,88.51 62.62,91.31 D7.1
$1N64965: length 3.4
  Top Layer w0.254: R31.2 29.5,66.83 29.49,66.82 U11.1
$1N65241: length 3.5
  Top Layer w0.254: U12.1 52.25,66.62 52.04,66.83 R34.2
$1N65547: length 7.5
  Top Layer w0.4: R5.1 58.06,85.09 58.81,85.84 D8.1
$1N72390: length 12.7
  Top Layer w0.8: U3.2 86.78,79.68 90.62,75.84 L1.2
  Top Layer w1: D4.2 90.71,75.84 L1.2
$1N72392: length 3.5
  Top Layer w0.6: R3.1 82.63,84.33 83.33,83.63 U3.4
$1N72469: length 12.2
  Top Layer w2: D1.1 81.96,58.64 85.37,58.64 ; F1.2 90.29,64.35 90.29,63.56
  Top Layer w2.5: 85.37,58.64 90.29,63.56
$1N72730: length 10.4
  Top Layer w0.6: R2.1 73.52,93.21 D5.1

## Copper pours and planes (outline as drawn; the poured copper is in the pictures)
5V_VCC on Top Layer: 67.82,81.95 73.02,81.95 73.02,77.41 67.82,77.41
24V on Top Layer: 92.76,66.6 95.56,66.6 95.56,57.73 92.76,57.73
PGND on Top Layer: 58.84,102.96 102.14,102.96 102.14,41.2 58.84,41.2
PGND on Top Layer: -1.41,61.04 100.77,61.04 102.35,59.46 102.35,40.94 101.12,39.72 70.52,39.72 69.2,38.39 69.2,4.73 65.78,1.32 60.78,1.32 22.12,39.97 -1.34,39.97 -1.41,40.04
PGND on Bottom Layer: -1.9,60.99 63.54,60.99 63.54,41.5 -1.9,41.5
PGND on Bottom Layer: 58.79,103.01 102.09,103.01 102.09,41.25 58.79,41.25
SGND on Top Layer: -0.88,100.66 -0.88,66.65 2.49,63.28 13.76,63.28 14.52,62.52 58.08,62.52 59.41,63.84 59.41,81.28 61.04,82.92 61.04,87.25 63.74,89.95 63.74,99.29 62.36,100.66
SGND on Bottom Layer: -0.67,100.41 -0.67,66.39 2.69,63.03 13.96,63.03 14.73,62.26 58.28,62.26 59.61,63.59 59.61,81.03 61.24,82.66 61.24,87 63.94,89.7 63.94,99.03 62.57,100.41
VIN_24V on Top Layer: 75.06,69.55 79,69.55 79,57.5 75.06,57.5
VIN_24V on Top Layer: 81.07,78.68 84,78.68 84,75.37 81.07,75.37
$1N72469 on Top Layer: 89.44,66.55 91.79,66.55 91.79,61.96 89.44,61.96
$1N72469 on Top Layer: 80.72,60.78 87.35,60.78 87.35,57.31 80.72,57.31

Small or netless copper shapes (teardrops, artwork), in the pictures only: 298 on Top Layer, 38 on Bottom Layer

## Text on the board
Bottom Silkscreen Layer: SW | PGND | OUT42 | SW2 | OUT41 | 24V+
Top Silkscreen Layer: DIO | CLK | 3V3 | GND | Channel2 | Channel1 | Power | S22 | S11 | A2- | S21 | 42 | 34 | 24 | 14 | S34 | A1+ | S33 | S12 | 23 | 33 | 13 | 41 | 3012 | Safety module v1.0
